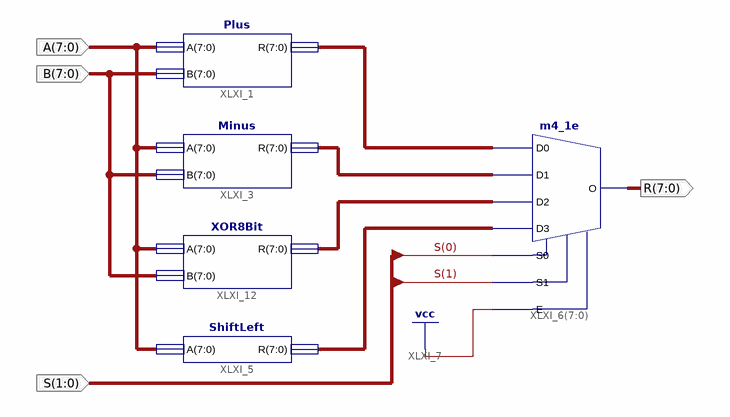
[diagram p0: schematic sheet 1]
// Xilinx ISE schematic ALUselect.sch (spartan6) as structural Verilog: 5 symbols, 4 ports
module ALUselect (
  input  [7:0] A,
  input  [1:0] S,
  input  [7:0] B,
  output [7:0] R
);

  wire [7:0] R_Minus, R_Plus, R_Shift, R_XOR;

  Plus XLXI_1 (.A(A), .B(B), .R(R_Plus));
  Minus XLXI_3 (.A(A), .B(B), .R(R_Minus));
  ShiftLeft XLXI_5 (.A(A), .R(R_Shift));
  m4_1e XLXI_6[7:0] (.D0(R_Plus), .D1(R_Minus), .D2(R_XOR), .D3(R_Shift), .E(1'b1), .S0(S[0]), .S1(S[1]), .O(R));
  XOR8Bit XLXI_12 (.A(A), .B(B), .R(R_XOR));
endmodule
